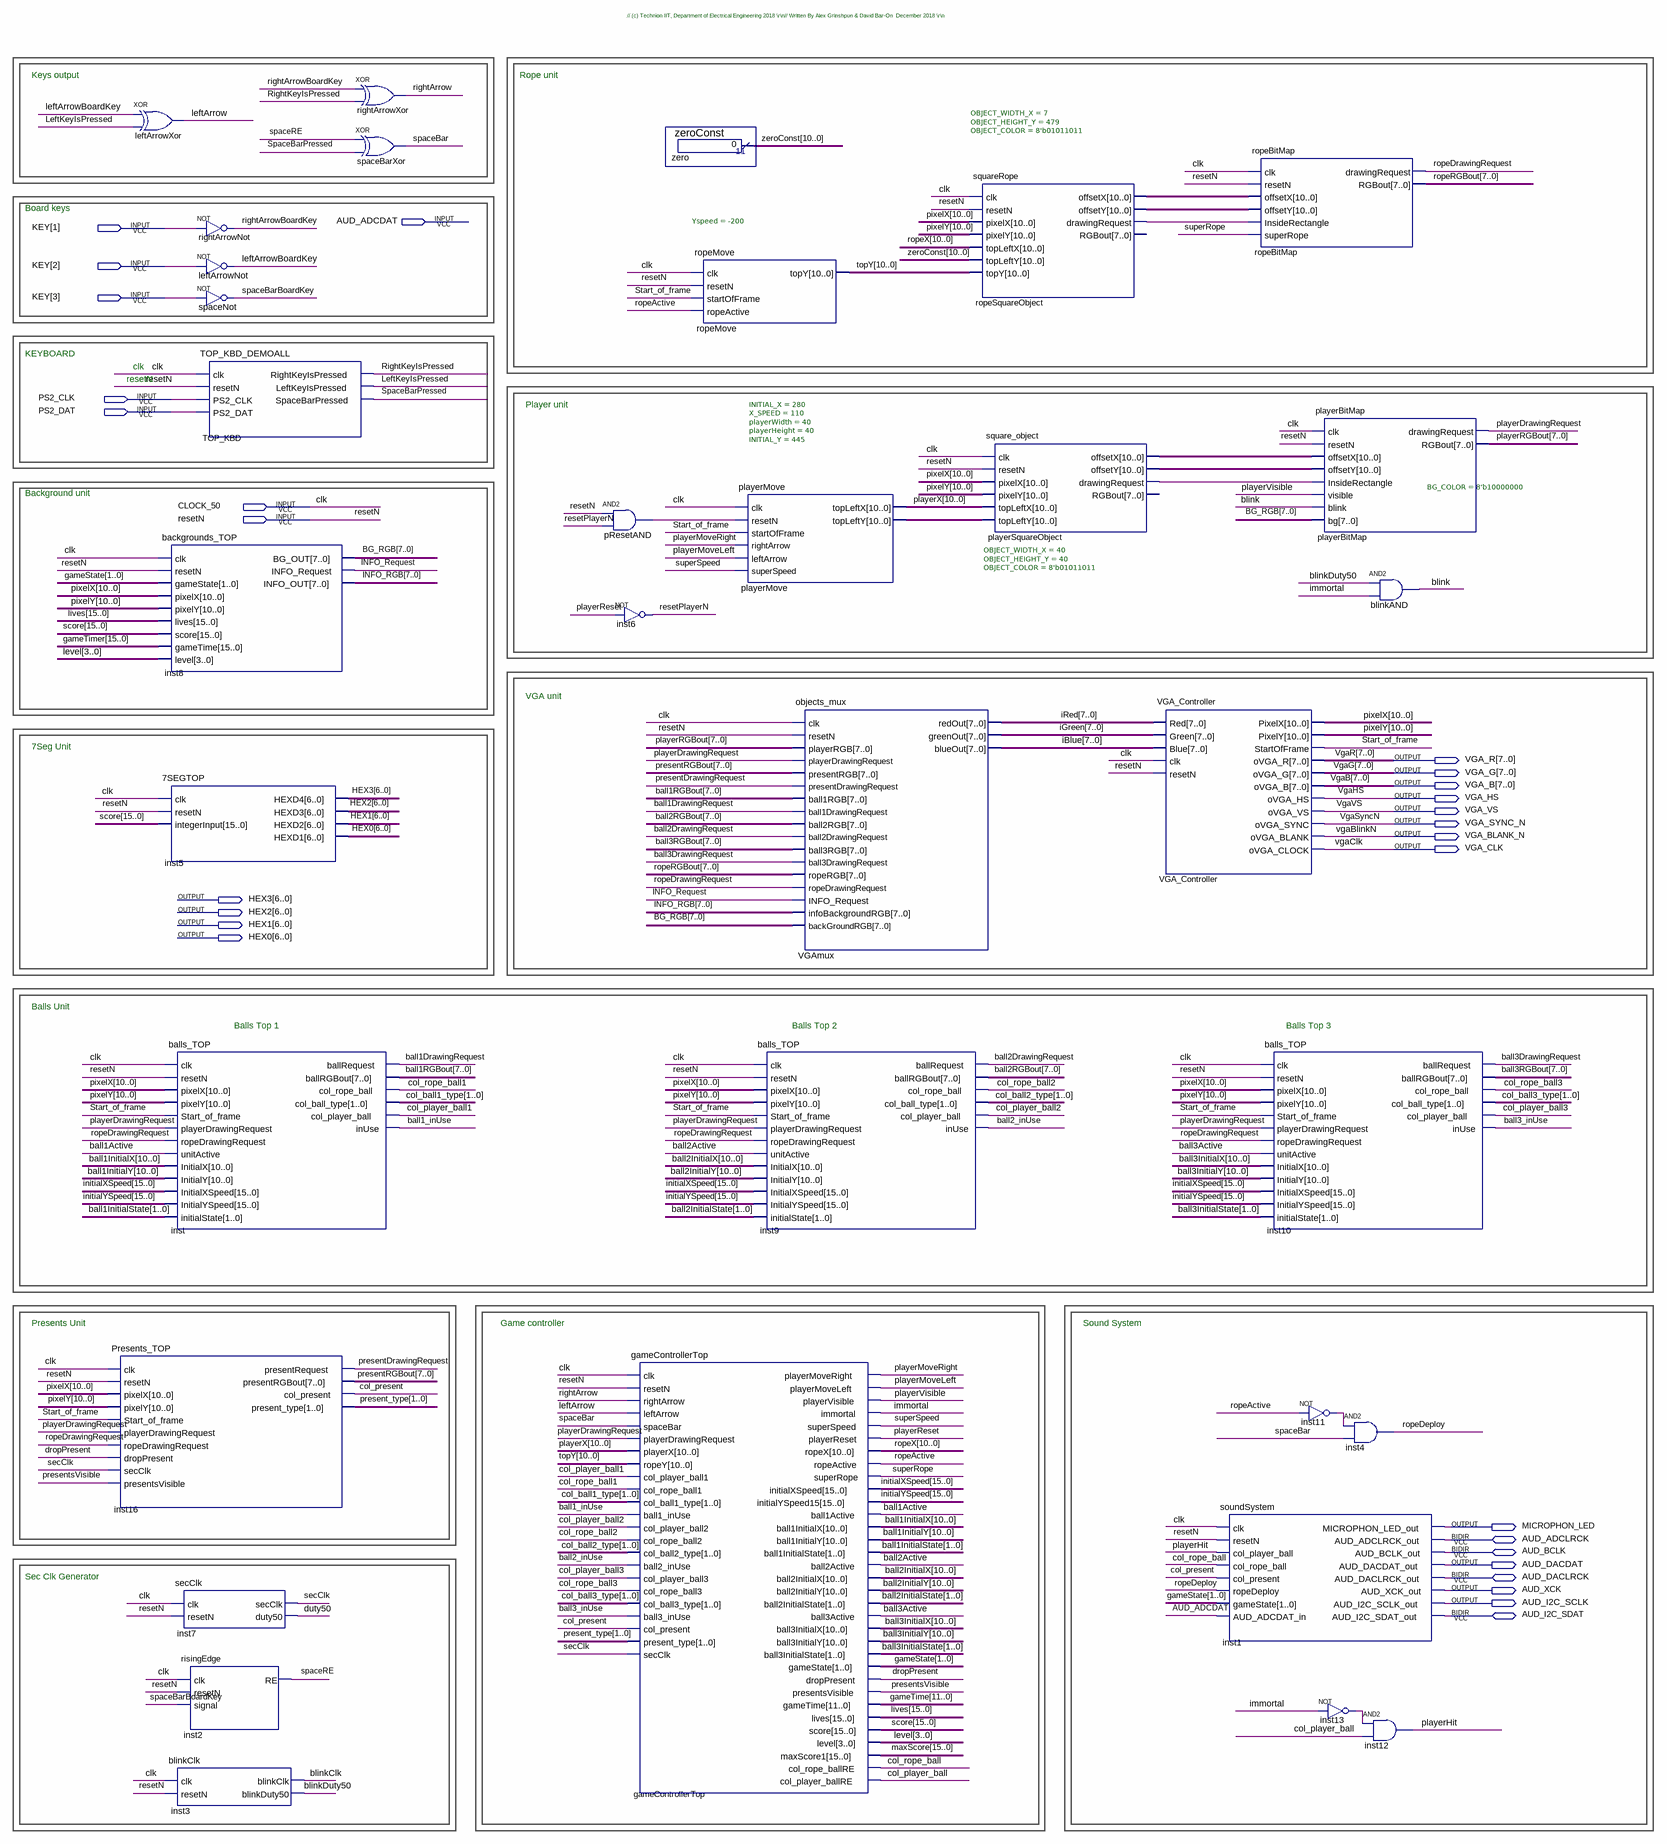
[diagram p0: schematic sheet]
// Quartus schematic TOP_VGA_DEMO_WITH_MSS_ALL.bdf as structural Verilog: 34 symbols, 28 pins
module TOP_VGA_DEMO_WITH_MSS_ALL (
  input  AUD_ADCDAT,
  input  [3:1] KEY,
  input  PS2_CLK,
  input  PS2_DAT,
  input  CLOCK_50,
  input  resetN,
  inout  AUD_ADCLRCK,
  inout  AUD_BCLK,
  inout  AUD_DACLRCK,
  inout  AUD_I2C_SDAT,
  output [7:0] VGA_R,
  output [7:0] VGA_G,
  output [7:0] VGA_B,
  output VGA_HS,
  output VGA_VS,
  output VGA_SYNC_N,
  output VGA_BLANK_N,
  output VGA_CLK,
  output [6:0] HEX3,
  output [6:0] HEX2,
  output [6:0] HEX1,
  output [6:0] HEX0,
  output MICROPHON_LED,
  output AUD_DACDAT,
  output AUD_XCK,
  output AUD_I2C_SCLK
);

  wire ball1_inUse, ball1Active, ball1DrawingRequest, ball2_inUse, ball2Active, ball2DrawingRequest,
       ball3_inUse, ball3Active, ball3DrawingRequest, blink, blinkClk, blinkDuty50, col_player_ball,
       col_player_ball1, col_player_ball2, col_player_ball3, col_present, col_rope_ball, col_rope_ball1,
       col_rope_ball2, col_rope_ball3, dropPresent, duty50, immortal, INFO_Request, inst11_out, inst13_out,
       leftArrow, leftArrowBoardKey, LeftKeyIsPressed, playerDrawingRequest, playerHit, playerMoveLeft,
       playerMoveRight, playerReset, playerSquareObject_drawingrequest, playerVisible, presentDrawingRequest,
       presentsVisible, pResetAND_out, resetPlayerN, rightArrow, rightArrowBoardKey, RightKeyIsPressed,
       ropeActive, ropeDeploy, ropeDrawingRequest, ropeSquareObject_drawingrequest, secClk, spaceBar,
       spaceBarBoardKey, SpaceBarPressed, spaceRE, Start_of_frame, superRope, superSpeed;
  wire [1:0] ball1InitialState, ball2InitialState, ball3InitialState, col_ball1_type, col_ball2_type,
       col_ball3_type, gameState, present_type;
  wire [3:0] level;
  wire [7:0] ball1RGBout, ball2RGBout, ball3RGBout, BG_RGB, iBlue, iGreen, INFO_RGB, iRed, playerRGBout,
       presentRGBout, ropeRGBout;
  wire [10:0] ball1InitialX, ball1InitialY, ball2InitialX, ball2InitialY, ball3InitialX, ball3InitialY,
       pixelX, pixelY, playerMove_toplefty, playerSquareObject_offsetx, playerSquareObject_offsety, playerX,
       ropeSquareObject_offsetx, ropeSquareObject_offsety, ropeX, topY, zeroConst;
  wire [11:0] gameTime;
  wire [15:0] gameTimer, initialXSpeed, initialYSpeed, lives, maxScore, score;

  xor leftArrowXor (leftArrow, leftArrowBoardKey, LeftKeyIsPressed);
  Presents_TOP inst16 (
    .clk(CLOCK_50), .resetN(resetN), .pixelX(pixelX), .pixelY(pixelY), .Start_of_frame(Start_of_frame),
    .playerDrawingRequest(playerDrawingRequest), .ropeDrawingRequest(ropeDrawingRequest),
    .dropPresent(dropPresent), .secClk(secClk), .presentsVisible(presentsVisible),
    .presentRequest(presentDrawingRequest), .presentRGBout(presentRGBout), .col_present(col_present),
    .present_type(present_type));
  backgrounds_TOP inst8 (
    .clk(CLOCK_50), .resetN(resetN), .gameState(gameState), .pixelX(pixelX), .pixelY(pixelY), .lives(lives),
    .score(score), .gameTime(gameTimer), .level(level), .BG_OUT(BG_RGB), .INFO_Request(INFO_Request),
    .INFO_OUT(INFO_RGB));
  \7SEGTOP  inst5 (
    .clk(CLOCK_50), .resetN(resetN), .integerInput(score), .HEXD4(HEX3), .HEXD3(HEX2), .HEXD2(HEX1),
    .HEXD1(HEX0));
  balls_TOP inst (
    .clk(CLOCK_50), .resetN(resetN), .pixelX(pixelX), .pixelY(pixelY), .Start_of_frame(Start_of_frame),
    .playerDrawingRequest(playerDrawingRequest), .ropeDrawingRequest(ropeDrawingRequest),
    .unitActive(ball1Active), .InitialX(ball1InitialX), .InitialY(ball1InitialY),
    .InitialXSpeed(initialXSpeed), .InitialYSpeed(initialYSpeed), .initialState(ball1InitialState),
    .ballRequest(ball1DrawingRequest), .ballRGBout(ball1RGBout), .col_rope_ball(col_rope_ball1),
    .col_ball_type(col_ball1_type), .col_player_ball(col_player_ball1), .inUse(ball1_inUse));
  secClk inst7 (.clk(CLOCK_50), .resetN(resetN), .secClk(secClk), .duty50(duty50));
  risingEdge inst2 (.clk(CLOCK_50), .resetN(resetN), .signal(spaceBarBoardKey), .RE(spaceRE));
  blinkClk inst3 (.clk(CLOCK_50), .resetN(resetN), .blinkClk(blinkClk), .blinkDuty50(blinkDuty50));
  not rightArrowNot (rightArrowBoardKey, KEY[1]);
  not leftArrowNot (leftArrowBoardKey, KEY[2]);
  not spaceNot (spaceBarBoardKey, KEY[3]);
  TOP_KBD_DEMOALL TOP_KBD (
    .clk(CLOCK_50), .resetN(resetN), .PS2_CLK(PS2_CLK), .PS2_DAT(PS2_DAT),
    .RightKeyIsPressed(RightKeyIsPressed), .LeftKeyIsPressed(LeftKeyIsPressed),
    .SpaceBarPressed(SpaceBarPressed));
  xor rightArrowXor (rightArrow, rightArrowBoardKey, RightKeyIsPressed);
  xor spaceBarXor (spaceBar, spaceRE, SpaceBarPressed);
  and pResetAND (pResetAND_out, resetN, resetPlayerN);
  not inst6 (resetPlayerN, playerReset);
  gameControllerTop gameControllerTop (
    .clk(CLOCK_50), .resetN(resetN), .rightArrow(rightArrow), .leftArrow(leftArrow), .spaceBar(spaceBar),
    .playerDrawingRequest(playerDrawingRequest), .playerX(playerX), .ropeY(topY),
    .col_player_ball1(col_player_ball1), .col_rope_ball1(col_rope_ball1), .col_ball1_type(col_ball1_type),
    .ball1_inUse(ball1_inUse), .col_player_ball2(col_player_ball2), .col_rope_ball2(col_rope_ball2),
    .col_ball2_type(col_ball2_type), .ball2_inUse(ball2_inUse), .col_player_ball3(col_player_ball3),
    .col_rope_ball3(col_rope_ball3), .col_ball3_type(col_ball3_type), .ball3_inUse(ball3_inUse),
    .col_present(col_present), .present_type(present_type), .secClk(secClk),
    .playerMoveRight(playerMoveRight), .playerMoveLeft(playerMoveLeft), .playerVisible(playerVisible),
    .immortal(immortal), .superSpeed(superSpeed), .playerReset(playerReset), .ropeX(ropeX),
    .ropeActive(ropeActive), .superRope(superRope), .initialXSpeed(initialXSpeed),
    .initialYSpeed15(initialYSpeed), .ball1Active(ball1Active), .ball1InitialX(ball1InitialX),
    .ball1InitialY(ball1InitialY), .ball1InitialState(ball1InitialState), .ball2Active(ball2Active),
    .ball2InitialX(ball2InitialX), .ball2InitialY(ball2InitialY), .ball2InitialState(ball2InitialState),
    .ball3Active(ball3Active), .ball3InitialX(ball3InitialX), .ball3InitialY(ball3InitialY),
    .ball3InitialState(ball3InitialState), .gameState(gameState), .dropPresent(dropPresent),
    .presentsVisible(presentsVisible), .gameTime(gameTime), .lives(lives), .score(score), .level(level),
    .maxScore1(maxScore), .col_rope_ballRE(col_rope_ball), .col_player_ballRE(col_player_ball));
  zeroConst zero (.result(zeroConst));
  ropeMove #(.Yspeed(-200)) ropeMove (
    .clk(CLOCK_50), .resetN(resetN), .startOfFrame(Start_of_frame), .ropeActive(ropeActive), .topY(topY));
  playerMove #(.INITIAL_X(280), .X_SPEED(110), .playerWidth(40), .playerHeight(40), .INITIAL_Y(445)) playerMove (
    .clk(CLOCK_50), .resetN(pResetAND_out), .startOfFrame(Start_of_frame), .rightArrow(playerMoveRight),
    .leftArrow(playerMoveLeft), .superSpeed(superSpeed), .topLeftX(playerX), .topLeftY(playerMove_toplefty));
  objects_mux VGAmux (
    .clk(CLOCK_50), .resetN(resetN), .playerRGB(playerRGBout), .playerDrawingRequest(playerDrawingRequest),
    .presentRGB(presentRGBout), .presentDrawingRequest(presentDrawingRequest), .ball1RGB(ball1RGBout),
    .ball1DrawingRequest(ball1DrawingRequest), .ball2RGB(ball2RGBout),
    .ball2DrawingRequest(ball2DrawingRequest), .ball3RGB(ball3RGBout),
    .ball3DrawingRequest(ball3DrawingRequest), .ropeRGB(ropeRGBout), .ropeDrawingRequest(ropeDrawingRequest),
    .INFO_Request(INFO_Request), .infoBackgroundRGB(INFO_RGB), .backGroundRGB(BG_RGB), .redOut(iRed),
    .greenOut(iGreen), .blueOut(iBlue));
  balls_TOP inst9 (
    .clk(CLOCK_50), .resetN(resetN), .pixelX(pixelX), .pixelY(pixelY), .Start_of_frame(Start_of_frame),
    .playerDrawingRequest(playerDrawingRequest), .ropeDrawingRequest(ropeDrawingRequest),
    .unitActive(ball2Active), .InitialX(ball2InitialX), .InitialY(ball2InitialY),
    .InitialXSpeed(initialXSpeed), .InitialYSpeed(initialYSpeed), .initialState(ball2InitialState),
    .ballRequest(ball2DrawingRequest), .ballRGBout(ball2RGBout), .col_rope_ball(col_rope_ball2),
    .col_ball_type(col_ball2_type), .col_player_ball(col_player_ball2), .inUse(ball2_inUse));
  squareRope #(.OBJECT_WIDTH_X(7), .OBJECT_HEIGHT_Y(479), .OBJECT_COLOR(8'b01011011)) ropeSquareObject (
    .clk(CLOCK_50), .resetN(resetN), .pixelX(pixelX), .pixelY(pixelY), .topLeftX(ropeX),
    .topLeftY(zeroConst), .topY(topY), .offsetX(ropeSquareObject_offsetx),
    .offsetY(ropeSquareObject_offsety), .drawingRequest(ropeSquareObject_drawingrequest));  // open: RGBout
  square_object #(.OBJECT_WIDTH_X(40), .OBJECT_HEIGHT_Y(40), .OBJECT_COLOR(8'b01011011)) playerSquareObject (
    .clk(CLOCK_50), .resetN(resetN), .pixelX(pixelX), .pixelY(pixelY), .topLeftX(playerX),
    .topLeftY(playerMove_toplefty), .offsetX(playerSquareObject_offsetx),
    .offsetY(playerSquareObject_offsety), .drawingRequest(playerSquareObject_drawingrequest));  // open: RGBout
  VGA_Controller VGA_Controller (
    .Red(iRed), .Green(iGreen), .Blue(iBlue), .clk(CLOCK_50), .resetN(resetN), .PixelX(pixelX),
    .PixelY(pixelY), .StartOfFrame(Start_of_frame), .oVGA_R(VGA_R), .oVGA_G(VGA_G), .oVGA_B(VGA_B),
    .oVGA_HS(VGA_HS), .oVGA_VS(VGA_VS), .oVGA_SYNC(VGA_SYNC_N), .oVGA_BLANK(VGA_BLANK_N), .oVGA_CLOCK(VGA_CLK));
  ropeBitMap ropeBitMap (
    .clk(CLOCK_50), .resetN(resetN), .offsetX(ropeSquareObject_offsetx), .offsetY(ropeSquareObject_offsety),
    .InsideRectangle(ropeSquareObject_drawingrequest), .superRope(superRope),
    .drawingRequest(ropeDrawingRequest), .RGBout(ropeRGBout));
  soundSystem inst1 (
    .clk(CLOCK_50), .resetN(resetN), .col_player_ball(playerHit), .col_rope_ball(col_rope_ball),
    .col_present(col_present), .ropeDeploy(ropeDeploy), .gameState(gameState), .AUD_ADCDAT_in(AUD_ADCDAT),
    .MICROPHON_LED_out(MICROPHON_LED), .AUD_ADCLRCK_out(AUD_ADCLRCK), .AUD_BCLK_out(AUD_BCLK),
    .AUD_DACDAT_out(AUD_DACDAT), .AUD_DACLRCK_out(AUD_DACLRCK), .AUD_XCK_out(AUD_XCK),
    .AUD_I2C_SCLK_out(AUD_I2C_SCLK), .AUD_I2C_SDAT_out(AUD_I2C_SDAT));
  balls_TOP inst10 (
    .clk(CLOCK_50), .resetN(resetN), .pixelX(pixelX), .pixelY(pixelY), .Start_of_frame(Start_of_frame),
    .playerDrawingRequest(playerDrawingRequest), .ropeDrawingRequest(ropeDrawingRequest),
    .unitActive(ball3Active), .InitialX(ball3InitialX), .InitialY(ball3InitialY),
    .InitialXSpeed(initialXSpeed), .InitialYSpeed(initialYSpeed), .initialState(ball3InitialState),
    .ballRequest(ball3DrawingRequest), .ballRGBout(ball3RGBout), .col_rope_ball(col_rope_ball3),
    .col_ball_type(col_ball3_type), .col_player_ball(col_player_ball3), .inUse(ball3_inUse));
  not inst11 (inst11_out, ropeActive);
  playerBitMap #(.BG_COLOR(8'b10000000)) playerBitMap (
    .clk(CLOCK_50), .resetN(resetN), .offsetX(playerSquareObject_offsetx),
    .offsetY(playerSquareObject_offsety), .InsideRectangle(playerSquareObject_drawingrequest),
    .visible(playerVisible), .blink(blink), .bg(BG_RGB), .drawingRequest(playerDrawingRequest),
    .RGBout(playerRGBout));
  and inst4 (ropeDeploy, inst11_out, spaceBar);
  not inst13 (inst13_out, immortal);
  and blinkAND (blink, blinkDuty50, immortal);
  and inst12 (playerHit, inst13_out, col_player_ball);

  // Other names for the same wires on the sheet: clk = CLOCK_50; VgaB[7:0] = VGA_B; vgaBlinkN = VGA_BLANK_N;
  //   vgaClk = VGA_CLK; VgaG[7:0] = VGA_G; VgaHS = VGA_HS; VgaR[7:0] = VGA_R; VgaSyncN = VGA_SYNC_N; VgaVS = VGA_VS

  // Notes on the sheet:
  //   // (c) Technion IIT, Department of Electrical Engineering 2018 \r\n// Written By Alex Grinshpun & David Bar-On  December 2018 \r\n
  //   Keys output
  //   Rope unit
  //   Board keys
  //   KEYBOARD
  //   clk
  //   resetN
  //   Player unit
  //   Background unit
  //   VGA unit
  //   7Seg Unit
  //   Balls Unit
  //   Balls Top 1
  //   Balls Top 2
  //   Balls Top 3
  //   Presents Unit
  //   Game controller
  //   Sound System
  //   Sec Clk Generator
endmodule
